# Altium project Camera_Board.PrjPcb
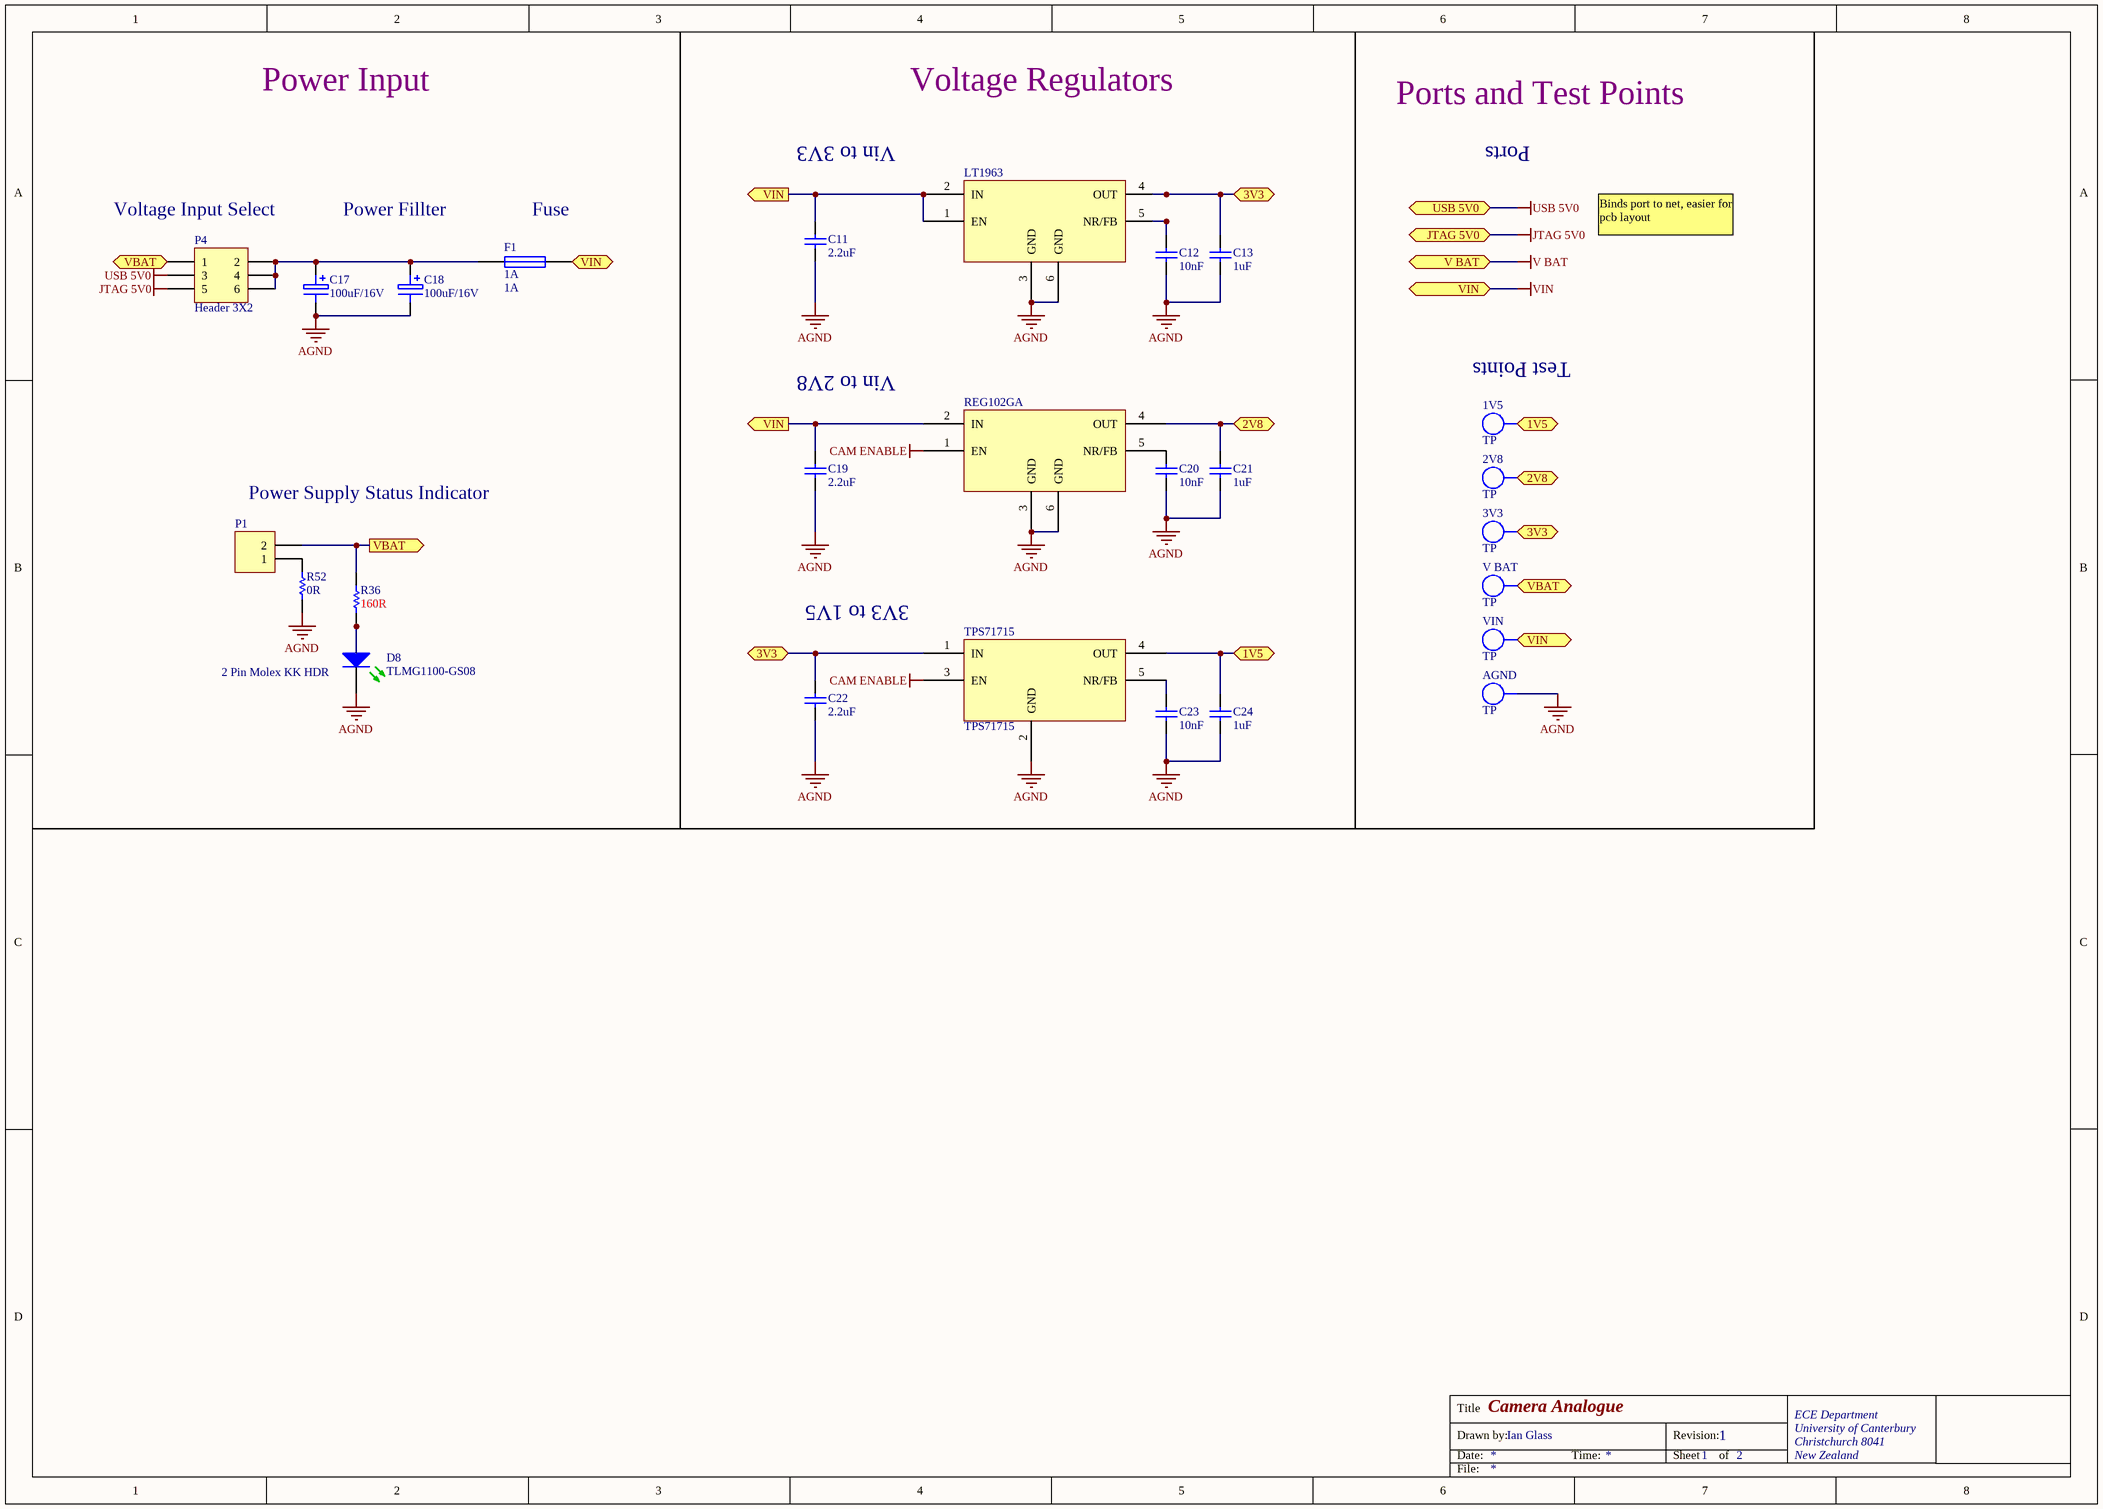
[diagram p0: Camera_Analogue.SchDoc]
1 sheet, 26 parts. Net scope: flat (ports and power ports of the same name join across sheets).
Board file: Camera_PCB.PcbDoc

## Sheet Camera_Analogue.SchDoc: Camera Analogue
size A3; DrawnBy: Ian Glass; Address1: ECE Department; Address2: University of Canterbury; Address3: Christchurch 8041; Address4: New Zealand; Revision: 1; SheetNumber: 1; SheetTotal: 2; PageSetup: Record=PageOptions|CenterHorizontal=True|CenterVertical=True|PrintScale=1.01|XCorrection=1.00|YCorrection=1.00|PrintKind=1|BorderSize=5000000|LeftOffset=0|BottomOffset=0|Orientation=2|PaperLength=1000|PaperWidth=1000|Scale=100|PaperSource=15|PrintQuality=600|MediaType=1|DitherType=10|PaperKind=A3|PrintScaleMode=1

### Parts
1V5  TP  [TEST_POINT_3.5X2MM]  (no BOM)
2V8  TP  [TEST_POINT_3.5X2MM]  (no BOM)
3V3  TP  [TEST_POINT_3.5X2MM]  (no BOM)
AGND  TP  [TEST_POINT_3.5X2MM]  (no BOM)
C11  2.2uF  [CAPC2012L]
C12  10nF  [CAPC1608L]
C13  1uF  [CAPC1608L]
C17  100uF/16V  [NICH-1]
C18  100uF/16V  [NICH-1]
C19  2.2uF  [CAPC2012L]
C20  10nF  [CAPC1608L]
C21  1uF  [CAPC1608L]
C22  2.2uF  [CAPC2012L]
C23  10nF  [CAPC1608L]
C24  1uF  [CAPC1608L]
D8  TLMG1100-GS08  [LED0.8X1.6]
F1  1A  [RESC3216N]
P1  2 Pin Molex KK HDR  [MOLEX_KK_2_HDR]
P4  Header 3X2  [HDR2X3]
R36  160R  [RESC1608L]
R52  0R  [RESC1608L]
REG102GA  REG102GA  [SOT223-6M]
TPS796xx  LT1963  [SOT223-6M]
TPS71715  TPS71715  [SOT23-5AN]
V_BAT  TP  [TEST_POINT_3.5X2MM]  (no BOM)
VIN  TP  [TEST_POINT_3.5X2MM]  (no BOM)

### Ports
1V5, 2V8, 3V3, JTAG 5V0, USB 5V0, V BAT, VBAT (in), VBAT (out), VIN, VIN (in), VIN (out)

### Nets
AGND: AGND.1 C11.2 C12.1 C13.1 C17.1 C18.1 C19.2 C20.1 C21.1 C22.2 C23.1 C24.1 D8.2(K) R52.1 REG102GA.3(GND) REG102GA.6(GND) TPS796xx.3(GND) TPS796xx.6(GND) TPS71715.2(GND)
CAM ENABLE: REG102GA.1(EN) TPS71715.3(EN)
JTAG 5V0: P4.5 ; port JTAG 5V0
USB 5V0: P4.3 ; port USB 5V0
V BAT: port V BAT
VIN: C11.1 C19.1 F1.2 REG102GA.2(IN) TPS796xx.1(EN) TPS796xx.2(IN) VIN.1 ; port VIN
Net1V5_1: 1V5.1 C24.2 TPS71715.4(OUT) ; port 1V5
Net2V8_1: 2V8.1 C21.2 REG102GA.4(OUT) ; port 2V8
Net3V3_1: 3V3.1 C13.2 C22.1 TPS796xx.4(OUT) TPS71715.1(IN) ; port 3V3
NetC12_2: C12.2 TPS796xx.5(NR/FB)
NetC17_2: C17.2 C18.2 F1.1 P4.2 P4.4 P4.6
NetC20_2: C20.2 REG102GA.5(NR/FB)
NetC23_2: C23.2 TPS71715.5(NR/FB)
NetD8_1: D8.1(A) R36.1
NetP1_1: P1.1 R52.2
NetP1_2: P1.2 P4.1 R36.2 V_BAT.1 ; port VBAT

### Notes on the sheet
- Power Input
- Voltage Regulators
- Ports and Test Points
- Vin to 3V3
- Ports
- Voltage Input Select
- Power Fillter
- (near F1) Fuse
- Binds port to net, easier for pcb layout
- Vin to 2V8
- (near 1V5) Test Points
- (near P1) Power Supply Status Indicator
- 3V3 to 1V5
- Title
- Drawn by:
- Date:
- Time:
- Revision:
- Sheet
- of
- File:

### Library data of the parts
1V5 2V8 3V3 AGND V_BAT VIN = TP_TESTPOINT: Test-Point; LatestRevisionDate: 29 May 08; Manufacturer PN: *; Manufacturer: *; Supplier 1: Digi-Key; Supplier Part Number 1: 5016KTR-ND; Value: TP; Part Number: TP_TESTPOINT; Component Type: Standard (No BOM); Designator: TP_TESTPOINT; Footprint: TEST_POINT_4X2MM; Pin Count: 1
C11 C19 C22 = CC_2.2uF_0805: CAP CER 2.2uF Y5V -20% +80% 25V 0805; Note: Footprint corresponds to dimensions for bulk cassette packaging. This case size has tightened tolerances.; PackageReference: 0805; Code_IPC: 2012[0805]; Verify: *; Supplier: ECE Dept Stock; Storage Location: Pottle; Value: 2.2uF
C12 C20 C23 = CC_10nF_0603: CAP CER 10nF X7R +-10% 50V 0603; PackageReference: 0603; Code_IPC: 1608 [0603]; Verify: *; Supplier: ECE Dept Stock; Storage Location: Pottle; Value: 10nF
C13 C21 C24 = CC_1uF_0603: CAP CER 1uF Y5V -20% +80% 16V 0603; PackageReference: 0603; Code_IPC: 1608 [0603]; Verify: *; Supplier: ECE Dept Stock; Storage Location: Pottle; Value: 1uF
C17 C18 = CA_100uF_16V_SMD: Nichcon WX series  SMT Aluminium Electrolytic Cap; Manufacturer PN: UWX1C101MCL1GB; Value: 100uF @ 16V; Manufacturer: Nichcon; Supplier 1: ECE Stock
D8 = DL_TLMG1100: LED Green 0603; Manufacturer: Vishay Semiconductor Opto Division; Millicandela Rating: 35mcd; Voltage - Forward (Vf) Typ: 2.1V; Viewing Angle: 160°; Wavelength - Peak: 572nm; Supplier 1: Farnell; Supplier 2: Digi-Key; Color: Green; Package / Case: 0603 (1608 Metric); Packaging: Cut Tape (CT); Size / Dimension: 1.60mm L x 0.80mm W; Pricing: 1=0.67, 10=0.525, 25=0.4376, 100=0.359, 250=0.29912, 500=0.24852, 1000=0.18408 (NZD); Supplier Part Number 1: 2293494; Supplier Part Number 2: 751-1165-1-ND; Manufacturer Part Number: TLMG1100-GS08
F1 = FS_Fuse_1.0A_SMD_1206: Fuse 1.0A Very Fast Acting 1206; Manufacturer: Multicomp; Manufacturer PN: MC12CF 001; Supplier: Lab Stock; Storage Location: *; Value: 1A
P1 = JA_MOLEX_KK_2POS: CONN HEADER 2POS 2.54mm VERT_Thru Hole; Supplier 1: Farnell; Supplier Part Number 1: 1462926; Supplier 2: ECE Store; Value: 2 Pin Molex KK HDR
P4 = Header 3X2: Header, 3-Pin, Dual row; LatestRevisionDate: 17-Jul-2002; LatestRevisionNote: Re-released for DXP Platform.; Publisher: Altium Limited
R36 = RS_160R: RES 160 OHM 1/10W 5% 0603 SMD; Storage Location: Red Pottel; Supplier: ECE Dept Stock; Value: 160R
R52 = RS_0R0: RES 0.0 OHM 1/10W 5% 0603 SMD; Storage Location: Protoplace; Supplier: ECE Dept Stock; Value: 0R
REG102GA TPS796xx = TSP796xx: ULTRALOW-NOISE, HIGH PSRR, FAST, RF, 1A  LOW-DROPOUT LINEAR REGULATORS
TPS71715 = TPS71715: ULTRALOW-NOISE, HIGH PSRR, FAST, RF, 1A  LOW-DROPOUT LINEAR REGULATORS